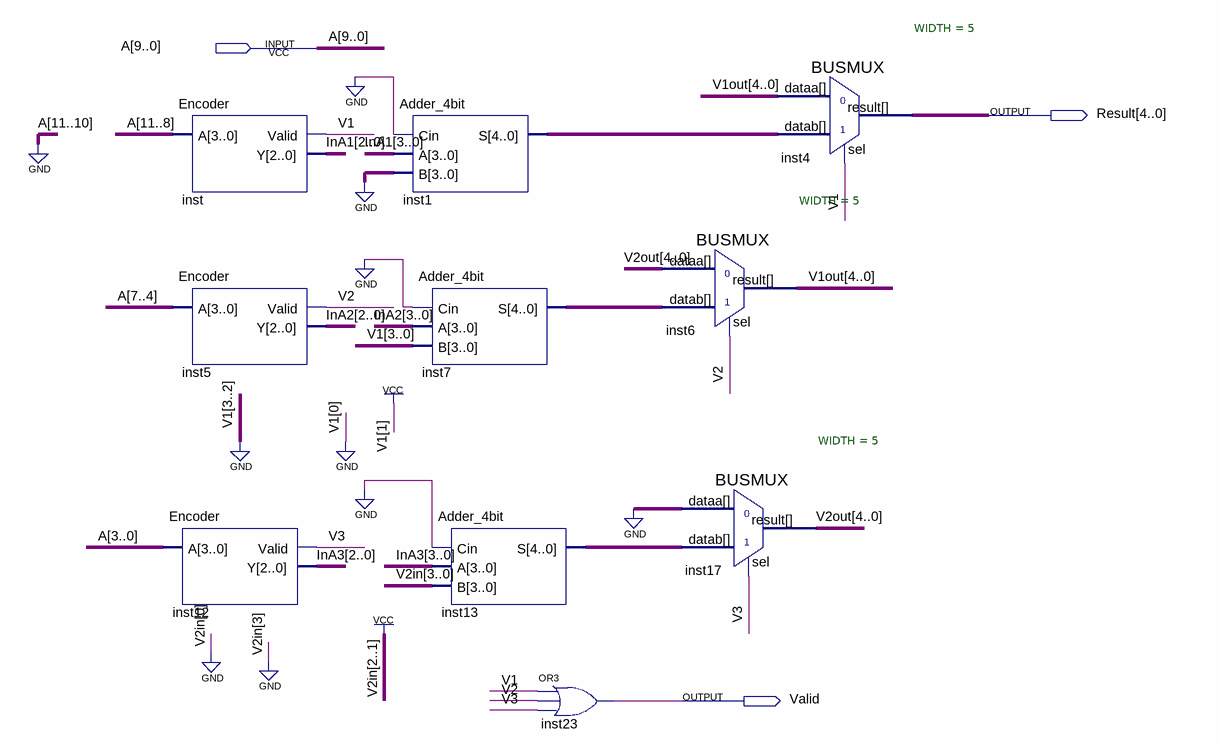
[diagram p0: schematic sheet]
// Quartus schematic Rounding_Logic.bdf as structural Verilog: 10 symbols, 3 pins
module Rounding_Logic (
  input  [9:0] A,
  output [4:0] Result,
  output Valid
);

  wire V1, V2, V3;
  wire [3:0] InA1, InA2, InA3;
  wire [4:0] inst1_s, inst7_s, inst13_s, V1out, V2out;

  Encoder inst (.A({2'b00, A[9:8]}), .Valid(V1), .Y(InA1[2:0]));
  Encoder inst5 (.A(A[7:4]), .Valid(V2), .Y(InA2[2:0]));
  Encoder inst12 (.A(A[3:0]), .Valid(V3), .Y(InA3[2:0]));
  Adder_4bit inst1 (.Cin(1'b0), .A(InA1), .B(4'b0000), .S(inst1_s));
  Adder_4bit inst7 (.Cin(1'b0), .A(InA2), .B(4'b0010), .S(inst7_s));
  Adder_4bit inst13 (.Cin(1'b0), .A(InA3), .B(4'b0110), .S(inst13_s));
  or inst23 (Valid, V1, V2, V3);
  BUSMUX #(.WIDTH(5)) inst6 (.datab(inst7_s), .sel(V2), .dataa(V2out), .result(V1out));
  BUSMUX #(.WIDTH(5)) inst17 (.datab(inst13_s), .sel(V3), .dataa({5{1'b0}}), .result(V2out));
  BUSMUX #(.WIDTH(5)) inst4 (.datab(inst1_s), .sel(V1), .dataa(V1out), .result(Result));
endmodule
